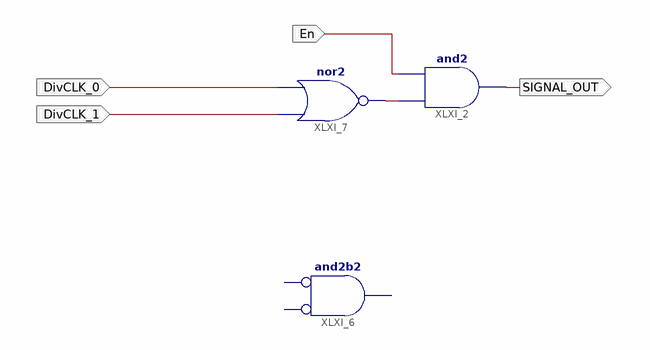
[diagram p0: schematic sheet 1]
// Xilinx ISE schematic RANGER_RD.sch (spartan3e) as structural Verilog: 3 symbols, 4 ports
module RANGER_RD (
  input  DivCLK_0,
  input  DivCLK_1,
  input  En,
  output SIGNAL_OUT
);

  wire XLXN_3;

  and XLXI_2 (SIGNAL_OUT, XLXN_3, En);
  // and2b2 XLXI_6 is placed but not wired
  nor XLXI_7 (XLXN_3, DivCLK_1, DivCLK_0);
endmodule
